# EAGLE schematic Power (EAGLE 6.2)
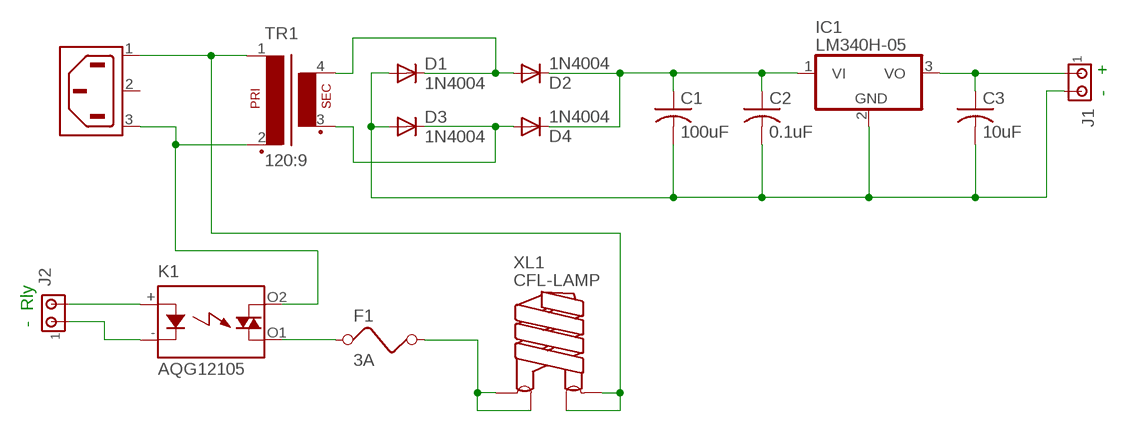
[diagram p0: schematic, sheet 1]

## Parts
C1  100uF  C-US075-032X103  [C075-032X103]
C2  0.1uF  C-US075-032X103  [C075-032X103]
C3  10uF  C-US075-032X103  [C075-032X103]
D1  1N4004  [DO41-10]
D2  1N4004  [DO41-10]
D3  1N4004  [DO41-10]
D4  1N4004  [DO41-10]
F1  3A  FUSE  [FUSE]
IC1  LM340H-05  [TO220H]
J1  MTA02-100  [10X02MTA]
J2  MTA02-100  [10X02MTA]
K1  AQG12105  [AQG]
TR1  120:9  VP31  [VP31]
X1  6ESRM-P  [6ESRM-P]
XL1  CFL-LAMP  [CFL-LAMP]

## Nets
N$1: C1.2 C2.2 C3.2 D1.A D3.A IC1.2(GND) J1.2
N$2: TR1.1 X1.1(AC1) XL1.2 XL1.4
N$3: D1.C D2.A TR1.4(S4)
N$4: D3.C D4.A TR1.3(S3)
N$5: C1.1 C2.1 D2.C D4.C IC1.1(VI)
N$6: K1.O2(DS1) TR1.2 X1.3(AC2)
N$7: J2.1 K1.-(K)
N$8: J2.2 K1.+(A)
N$9: C3.1 IC1.3(VO) J1.1
N$10: F1.2 XL1.1 XL1.3
N$11: F1.1 K1.O1(DS2)
Unconnected: X1.2(SH)

## Notes on the sheet
- -   +
- -  Rly

## Library data of the parts
C1-C3 = rcl:C-US: CAPACITOR, American symbol
D1-D4 = diode:1N4004: DIODE general purpose rectifier, 1 A
F1 = special:FUSE: FUSE 5 x 20 mm
IC1 = linear:LM340?-*: Positive VOLTAGE REGULATOR Source: http://cache.national.com/ds/LM/LM340.pdf
J1 J2 = con-amp:MTA02-100: AMP connector
K1 = relay:AQG*: SOLID STATE RELAY NAiS Zero-cross, Non zero-cross Source: http://www.mew-europe.com/.. en_ds_61611_0000.pdf; MF: AROMAT/ MATSUSHITA; MPN: AQG12105; OC_FARNELL: unknown; OC_NEWARK: 20J4759
TR1 = trafo:VP31: TRANSFORMER 1 primary winding, 1 secondary winding BLOCK
X1 = con-tycoelectronics:6ESRM-P: AC Connector 120/250 VAC Source: http://catalog.tycoelectronics.com .. ENG_DS_1654001_1099_SR_0406.pdf; MF: TYCO ELECTRONICS; MPN: 6ESRM-P; OC_FARNELL: unknown; OC_NEWARK: 87F1821
XL1 = ir:CFL-LAMP: fluorescent lamp; OC_FARNELL: unknown; OC_NEWARK: unknown